# Altium project WPT Round 3 TX.PrjPcb
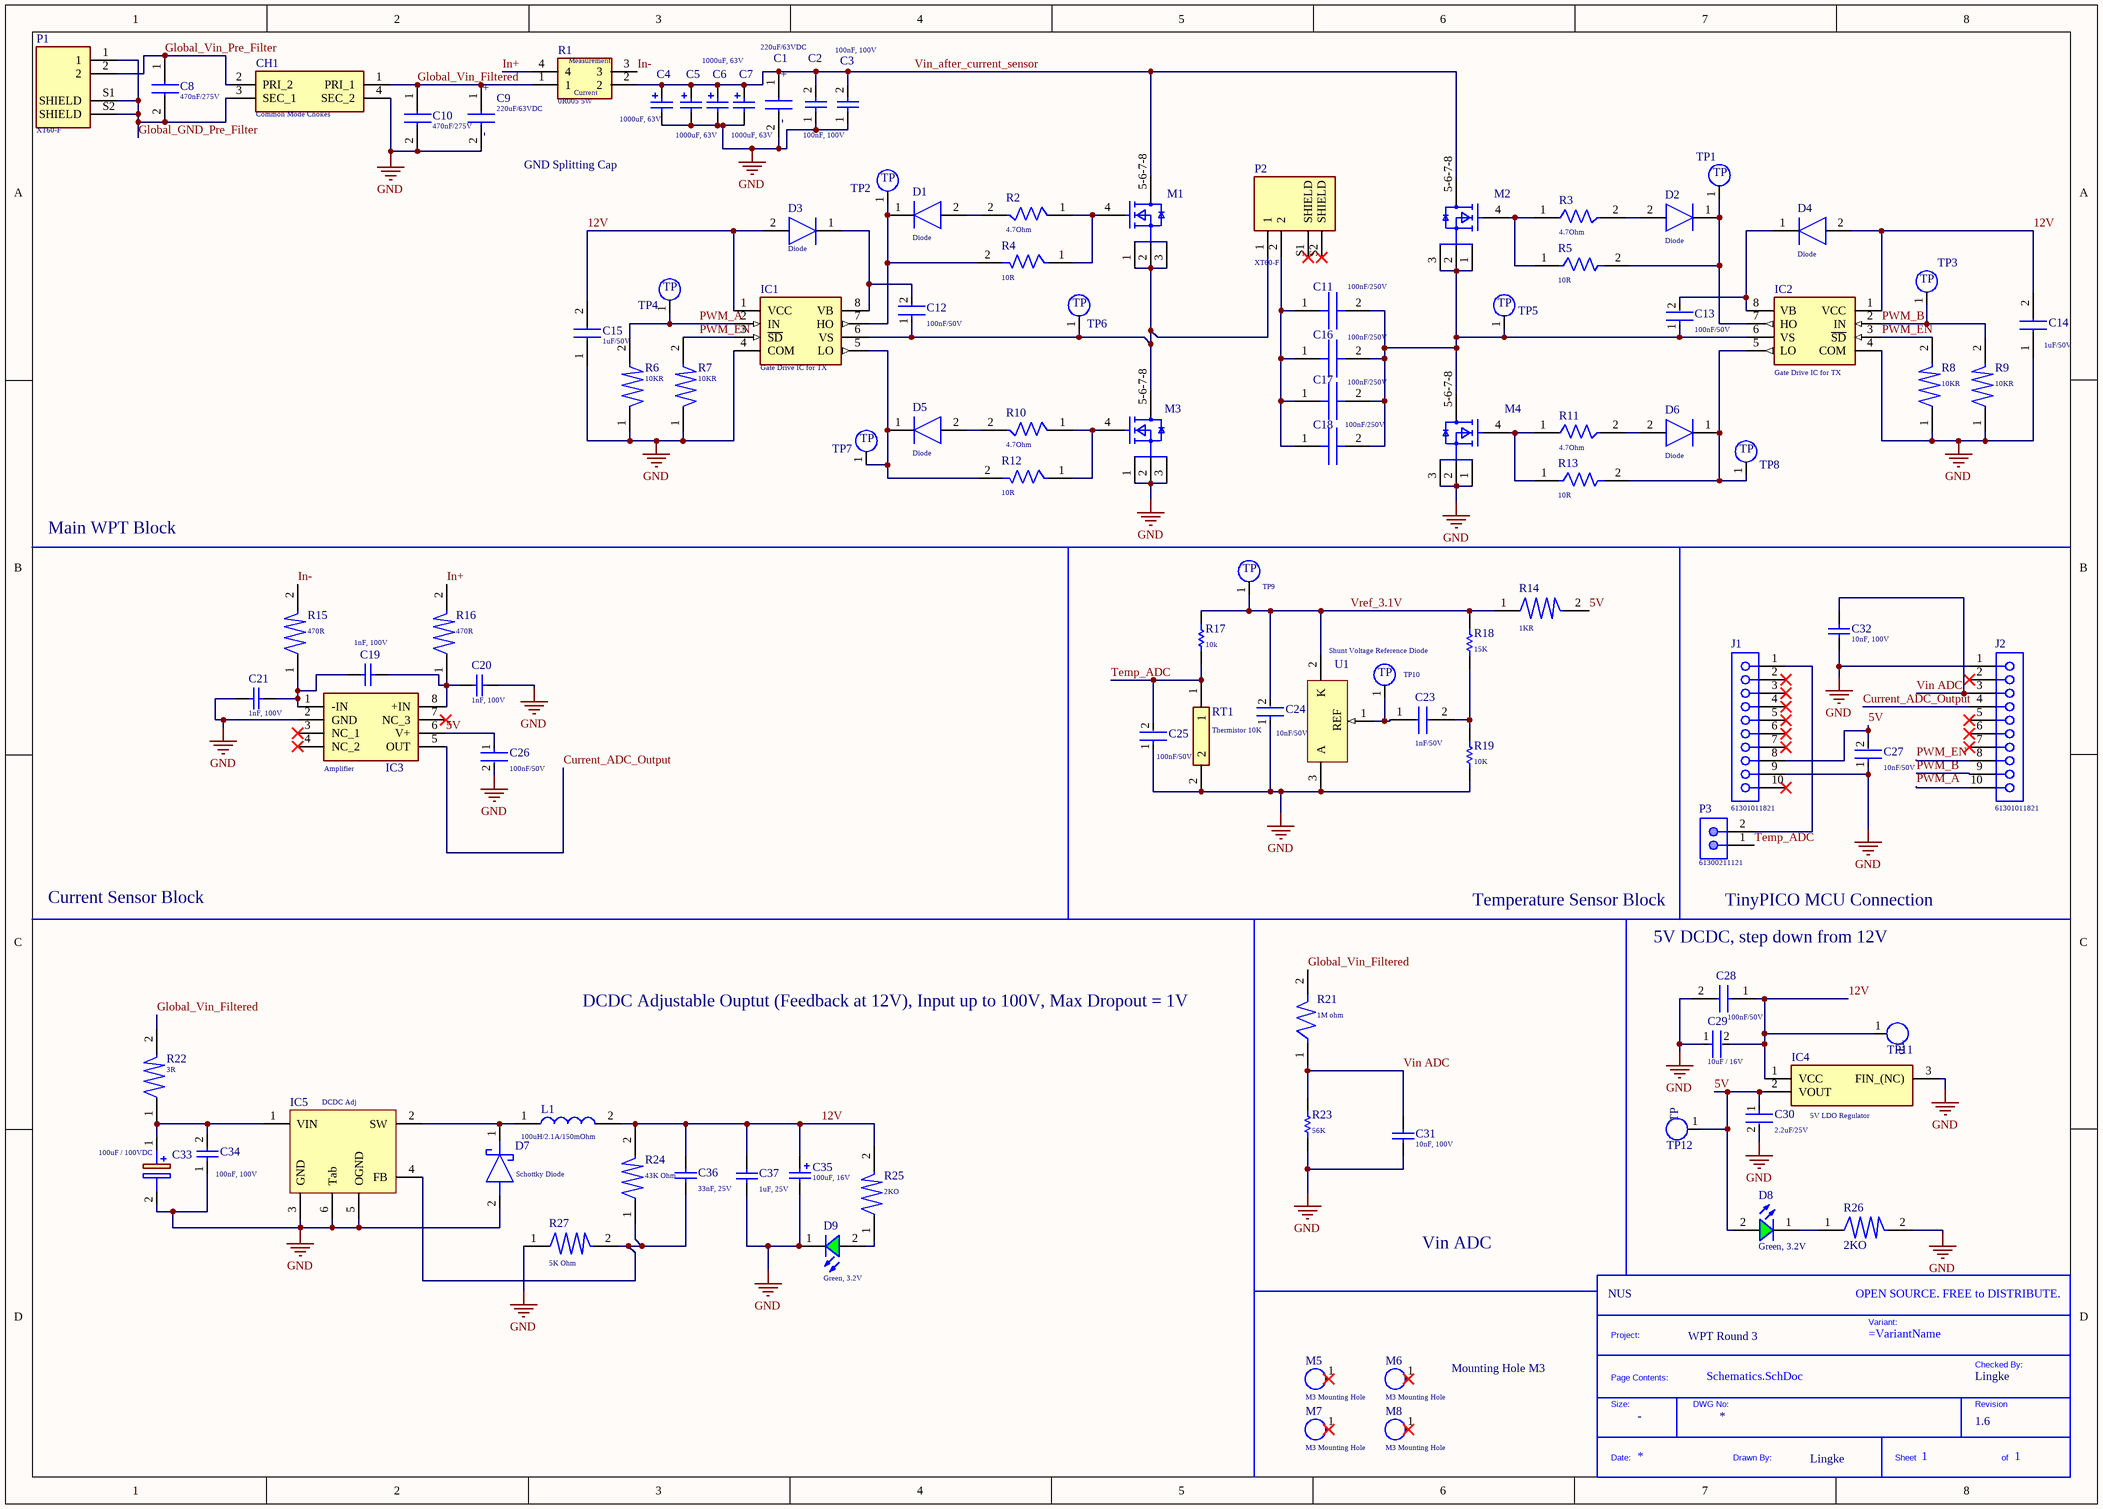
[diagram p0: Schematics.SchDoc]
1 sheet, 106 parts. Net scope: global (net labels, ports and power ports of the same name join across sheets).
Board file: WPT Round 3 TX Layout.PcbDoc

## Sheet Schematics.SchDoc
size A3; SheetNumber: 1; SheetTotal: 1

### Parts
*1  Project Name: WPT Round 3  Company: NUS  Drawn By: Lingke  Revision: 1.6  (hidden comment: Title_Block)  (no BOM)
C1  220uF/63VDC  [CAPPRD500W62D1000H2650]
C2  100nF, 100V  [WCAP-CSGP_0805_H=1.25mm]
C3  100nF, 100V  [WCAP-CSGP_0805_H=1.25mm]
C4  1000uF, 63V  [WCAP-ATG8_D16H25]
C5  1000uF, 63V  [WCAP-ATG8_D16H25]
C6  1000uF, 63V  [WCAP-ATG8_D16H25]
C7  1000uF, 63V  [WCAP-ATG8_D16H25]
C8  470nF/275V  [890324025039CS]
C9  220uF/63VDC  [CAPPRD500W62D1000H2650]
C10  470nF/275V  [890324025039CS]
C11  100nF/250V  [CAPC4532X220N]
C12  100nF/50V  [0805 Capacitor]
C13  100nF/50V  [0805 Capacitor]
C14  1uF/50V  [CAPC2012X135N]
C15  1uF/50V  [CAPC2012X135N]
C16  100nF/250V  [CAPC4532X220N]
C17  100nF/250V  [CAPC4532X220N]
C18  100nF/250V  [CAPC4532X220N]
C19  1nF, 100V  [WCAP-CSGP_0805_H=0.8mm_Reflow]
C20  1nF, 100V  [WCAP-CSGP_0805_H=0.8mm_Reflow]
C21  1nF, 100V  [WCAP-CSGP_0805_H=0.8mm_Reflow]
C23  1nF/50V  [CAPC2012X90N]
C24  10nF/50V  [0805 Capacitor]
C25  100nF/50V  [0805 Capacitor]
C26  100nF/50V  [0805 Capacitor]
C27  10nF/50V  [0805 Capacitor]
C28  100nF/50V  [CAPC2012X90N]
C29  10uF / 16V  [0805 Capacitor]
C30  2.2uF/25V  [0805 Capacitor]
C31  10nF, 100V  [WCAP-CSGP_0805_H=0.8mm_Reflow]
C32  10nF, 100V  [WCAP-CSGP_0805_H=0.8mm_Reflow]
C33  100uF / 100VDC  [CAPPRD500W60D1000H2200]
C34  100nF, 100V  [WCAP-CSGP_0805_H=1.25mm]
C35  100uF, 16V  [WCAP-ASLI_D6.3H5.5]
C36  33nF, 25V  [WCAP-CSGP_0805_H=0.8mm_Reflow]
C37  1uF, 25V  [WCAP-CSGP_0805_H=1.25mm]
CH1  Common Mode Chokes  [PA5141205NLT]
D1  Diode  [SOD3716X135N]
D2  Diode  [SOD3716X135N]
D3  Diode  [SOD3716X135N]
D4  Diode  [SOD3716X135N]
D5  Diode  [SOD3716X135N]
D6  Diode  [SOD3716X135N]
D7  Schottky Diode  [DIONM8059X265N]
D8  Green, 3.2V  [WL-SMCW_0805]
D9  Green, 3.2V  [WL-SMCW_0805]
IC1  Gate Drive IC for TX  [SOIC127P600X175-8N]
IC2  Gate Drive IC for TX  [SOIC127P600X175-8N]
IC3  Amplifier  [SOIC127P600X175-8N]
IC4  5V LDO Regulator  [ROHM_TO-252-3]
IC5  DCDC Adj  [TO-263-5]
J1  61301011821  [61301011821]
J2  61301011821  [61301011821]
L1  100uH/2.1A/150mOhm  [INDPM125125X800N]
M1  Mosfet  [FP-PG-TDSON-8-MFG]  (value not drawn)
M2  Mosfet  [FP-PG-TDSON-8-MFG]  (value not drawn)
M3  Mosfet  [FP-PG-TDSON-8-MFG]  (value not drawn)
M4  Mosfet  [FP-PG-TDSON-8-MFG]  (value not drawn)
M5  M3 Mounting Hole  [M3 Hole]
M6  M3 Mounting Hole  [M3 Hole]
M7  M3 Mounting Hole  [M3 Hole]
M8  M3 Mounting Hole  [M3 Hole]
P1  XT60-F  [AMASS_XT60PW-F]
P2  XT60-F  [AMASS_XT60PW-F]
P3  61300211121  [61300211121]
R1  0R005 5W  [FC4L110R005FER]
R2  4.7Ohm  [FP-CRCW1206-e3-IPC_A]
R3  4.7Ohm  [FP-CRCW1206-e3-IPC_A]
R4  10R  [FP-CRCW1206-e3-IPC_A]
R5  10R  [FP-CRCW1206-e3-IPC_A]
R6  10KR  [FP-CRCW0805-e3-MFG]
R7  10KR  [FP-CRCW0805-e3-MFG]
R8  10KR  [FP-CRCW0805-e3-MFG]
R9  10KR  [FP-CRCW0805-e3-MFG]
R10  4.7Ohm  [FP-CRCW1206-e3-IPC_A]
R11  4.7Ohm  [FP-CRCW1206-e3-IPC_A]
R12  10R  [FP-CRCW1206-e3-IPC_A]
R13  10R  [FP-CRCW1206-e3-IPC_A]
R14  1KR  [FP-CRCW0805-e3-MFG]
R15  470R  [FP-CRCW0805-e3-MFG]
R16  470R  [FP-CRCW0805-e3-MFG]
R17  10k  [0805 Resistor]
R18  15K  [0805 Resistor]
R19  10K  [0805 Resistor]
R21  1M ohm  [FP-CRCW0805-e3-MFG]
R22  3R  [1206_Resistor]
R23  56K  [0805 Resistor]
R24  43K Ohm  [FP-CRCW0805-e3-MFG]
R25  2KO  [FP-CRCW0805-e3-MFG]
R26  2KO  [FP-CRCW0805-e3-MFG]
R27  5K Ohm  [FP-CRCW0805-e3-MFG]
RT1  Thermistor 10K  [THRMC2012X95N]
TP1  TP  [Test Point]  (value not drawn)  (no BOM)
TP2  TP  [Test Point]  (value not drawn)  (no BOM)
TP3  TP  [Test Point]  (value not drawn)  (no BOM)
TP4  TP  [Test Point]  (value not drawn)  (no BOM)
TP5  TP  [Test Point]  (value not drawn)  (no BOM)
TP6  TP  [Test Point]  (value not drawn)  (no BOM)
TP7  TP  [Test Point]  (value not drawn)  (no BOM)
TP8  TP  [Test Point]  (value not drawn)  (no BOM)
TP9  TP  [Test Point]  (value not drawn)  (no BOM)
TP10  TP  [Test Point]  (value not drawn)  (no BOM)
TP11  TP  [Test Point]  (value not drawn)  (no BOM)
TP12  TP  [Test Point]  (value not drawn)  (no BOM)
U1  Shunt Voltage Reference Diode  [SOT23-3_N]

### Nets
GND: C1.2(-) C2.1 C3.1 C4.2(N) C5.2(N) C6.2(N) C7.2(N) C9.2(-) C10.2 C14.1 C15.1 C20.2 C21.1 C24.1 C25.1 C26.2 C27.1 C28.2 C29.1 C30.2 C31.1 C32.1 C33.2(-) C34.1 C35.2(N) C37.1 CH1.4(SEC_2) D7.2(A) D9.1(K) IC1.4(COM) IC2.4(COM) IC3.2(GND) IC4.3(FIN_(NC)) IC5.3(GND) IC5.5(OGND) IC5.6(Tab) J1.9 J2.1 M3.1(S) M3.2(S) M3.3(S) M4.1(S) M4.2(S) M4.3(S) R6.1 R7.1 R8.1 R9.1 R19.1 R23.1 R26.2 R27.1 RT1.2 U1.3(A)
5V: C26.1 C27.2 C30.1 D8.2(A) IC3.6(V+) IC4.2(VOUT) J1.8 R14.2 TP12.1(TP)
12V: C14.2 C15.2 C28.1 C29.2 C35.1(P) C36.2 C37.2 D3.2(A) D4.2(A) IC1.1(VCC) IC2.1(VCC) IC4.1(VCC) L1.2 R24.2 R25.2 TP11.1(TP)
Current_ADC_Output: IC3.5(OUT) J2.4
Global_GND_Pre_Filter: C8.2 CH1.3(SEC_1) P1.1 P1.S1(SHIELD) P1.S2(SHIELD)
Global_Vin_Filtered: C9.1(+) C10.1 CH1.1(PRI_1) R1.1 R21.2 R22.2
Global_Vin_Pre_Filter: C8.1 CH1.2(PRI_2) P1.2
In+: R1.4 R16.2
In-: R1.3 R15.2
PWM_A: IC1.2(IN) J2.10 R6.2 TP4.1(TP)
PWM_B: IC2.2(IN) J2.9 R9.2 TP3.1(TP)
PWM_EN: IC1.3(~{SD}) IC2.3(~{SD}) J2.8 R7.2 R8.2
Temp_ADC: C25.2 P3.1 R17.1 RT1.1
Vin ADC: C31.2 C32.2 J2.3 R21.1 R23.2
Vin_after_current_sensor: C1.1(+) C2.2 C3.2 C4.1(P) C5.1(P) C6.1(P) C7.1(P) M1.5-6-7-8(D) M2.5-6-7-8(D) R1.2
Vref_3.1V: C24.2 R14.1 R17.2 R18.2 TP9.1(TP) U1.2(K)
NetC11_1: C11.1 C16.1 C17.1 C18.1 P2.2
NetC11_2: C11.2 C13.1 C16.2 C17.2 C18.2 IC2.6(VS) M2.1(S) M2.2(S) M2.3(S) M4.5-6-7-8(D) TP5.1(TP)
NetC12_1: C12.1 IC1.6(VS) M1.1(S) M1.2(S) M1.3(S) M3.5-6-7-8(D) P2.1 TP6.1(TP)
NetC12_2: C12.2 D3.1(K) IC1.8(VB)
NetC13_2: C13.2 D4.1(K) IC2.8(VB)
NetC19_1: C19.1 C21.2 IC3.1(-IN) R15.1
NetC19_2: C19.2 C20.1 IC3.8(+IN) R16.1
NetC23_1: C23.1 TP10.1(TP) U1.1(REF)
NetC23_2: C23.2 R18.1 R19.2
NetC33_1: C33.1(+) C34.2 IC5.1(VIN) R22.1
NetC36_1: C36.1 IC5.4(FB) R24.1 R27.2
NetD1_1: D1.1(K) IC1.7(HO) R4.2 TP2.1(TP)
NetD1_2: D1.2(A) R2.2
NetD2_1: D2.1(K) IC2.7(HO) R5.2 TP1.1(TP)
NetD2_2: D2.2(A) R3.2
NetD5_1: D5.1(K) IC1.5(LO) R12.2 TP7.1(TP)
NetD5_2: D5.2(A) R10.2
NetD6_1: D6.1(K) IC2.5(LO) R13.2 TP8.1(TP)
NetD6_2: D6.2(A) R11.2
NetD7_1: D7.1(K) IC5.2(SW) L1.1
NetD8_1: D8.1(K) R26.1
NetD9_2: D9.2(A) R25.1
NetJ1_1: J1.1 P3.2
NetM1_4: M1.4(G) R2.1 R4.1
NetM2_4: M2.4(G) R3.1 R5.1
NetM3_4: M3.4(G) R10.1 R12.1
NetM4_4: M4.4(G) R11.1 R13.1

Not connected (* = marked no-connect by the designer): IC3 3(NC_1)* 4(NC_2)* 7(NC_3)*; J1 2* 3* 4* 5* 6* 7* 10*; J2 2* 5* 6* 7*; M5 1*; M6 1*; M7 1*; M8 1*; P2 S1(SHIELD)* S2(SHIELD)*

### Notes on the sheet
- GND Splitting Cap
- Main WPT Block
- Current Sensor Block
- Temperature Sensor Block
- (near P3) TinyPICO MCU Connection
- (near C28) 5V DCDC, step down from 12V
- (near R21) DCDC Adjustable Ouptut (Feedback at 12V), Input up to 100V, Max Dropout = 1V
- Vin ADC
- Mounting Hole M3
- (in symbol Title_Block) OPEN SOURCE. FREE to DISTRIBUTE.; Variant:; Project:; Checked By:; Page Contents:; Size:; DWG No:; Revision; Date:; Drawn By:; Sheet; of

### Library data of the parts
*1 = Title_Block: Standard Title Block.; DWG No: *; Size: -; Checked By: Lingke
C1 C9 = 860040775010: Polarised Cap, 220uF/63VDC; Manufacturer_Name: Wurth Elektronik; Datasheet Link: https://www.mouser.de/datasheet/2/445/860040775010-1725627.pdf; Height: 26.5mm; Manufacturer_Part_Number: 860040775010
C2 C3 C34 = 885012207128: WCAP-CSGP Multilayer Ceramic Chip Capacitor, General Purpose, size 0805, X7R, 100nF, 100V; Manufacturer: Wurth Elektronik; Rated Voltage: 100VDC; Isolation Resistance: >=1GOhm; Capacitance Tolerance: +/-10%; Technical Reference: X7R0805104K100DFCT10000; ComponentLink1Description: Manufacturer; ComponentLink1URL: http://www.we-online.de; ComponentLink2Description: Datasheet; ComponentLink2URL: https://www.we-online.com/catalog/datasheet/885012207128.pdf; Operating Temperature: -55 to +125degC; Packaging: Tape and Reel; Manufacturer Part Number: 885012207128; Published Date: May 2020; Ceramic Type: X7R; Dissipation Factor: =<2.5%; Height: 1.25mm; Mounting Technology: SMT; Size: 0805; Capacitance: 100nF
C4-C7 = 860010780024: WCAP-ATG8 Aluminum Electrolytic Capacitor, Radial, THT, D16xH25, 1000uF, 63V; Manufacturer: Wurth Elektronik; Ripple Current: 1540mA; Rated Voltage: 63VDC; Technical Reference: ATBK250102M063DSPAEB000; Leakage Current: 630uA; Endurance: 2000h; Dissipation Factor: 9%; Capacitance Tolerance: +/-20%; ComponentLink2Description: Datasheet; Published Date: October 2020; Packaging: Ammo Pack; Operating Temperature: -40 to +85degC; Mounting Technology: THT; Manufacturer Part Number: 860010780024; Height: 25mm; Diameter: 16mm; ComponentLink2URL: https://www.we-online.com/catalog/datasheet/860010780024.pdf; ComponentLink1URL: http://www.we-online.de; ComponentLink1Description: Manufacturer; Capacitance: 1000uF
C8 C10 = 890324025039CS: Safety Capacitor, 470nF/275V; Manufacturer_Name: Wurth Elektronik; Height: 14.5mm; Manufacturer_Part_Number: 890324025039CS
C11 C16-C18 = C1812C104JAGACAUTO: Manufacturer_Name: Kemet; Datasheet Link: https://api.kemet.com/component-edge/download/datasheet/C1812C104JAGACAUTO.pdf; Height: 2.2mm; Manufacturer_Part_Number: C1812C104JAGACAUTO; Supplier Part Number 1: 80-C1812C104JAGAUTO; Supplier 1: Mouser
C12 C13 C25 C26 = 885012207098: Supplier 1: Mouser; Supplier Part Number 1: 710-885012207098
C14 C15 = 885012207103: Capacitor 1uF/50V; Manufacturer_Name: Wurth Elektronik; Datasheet Link: https://katalog.we-online.com/pbs/datasheet/885012207103.pdf; Height: 1.35mm; Manufacturer_Part_Number: 885012207103; Supplier 1: Mouser; Supplier Part Number 1: 710-885012207103
C19-C21 = 885012207116: WCAP-CSGP Multilayer Ceramic Chip Capacitor, General Purpose, size 0805, X7R, 1nF, 100V; Manufacturer: Wurth Elektronik; Rated Voltage: 100VDC; Isolation Resistance  min.: 10GOhm; Capacitance Tolerance: +/-10%; Dissipation Factor max.: 2.5%; Technical Reference: X7R0805102K100DFCT10000; ComponentLink1Description: Manufacturer; ComponentLink1URL: http://www.we-online.de; ComponentLink2Description: Datasheet; ComponentLink2URL: https://www.we-online.com/catalog/datasheet/885012207116.pdf; Operating Temperature: -55 to +125degC; Packaging: Tape and Reel; Manufacturer Part Number: 885012207116; Published Date: April 2021; Ceramic Type: X7R; Height: 0.8mm; Mounting Technology: SMT; Size: 0805; Capacitance: 1nF; Q-Factor min.: -
C23 = 885012207086: Manufacturer_Name: Wurth Elektronik; Datasheet Link: https://katalog.we-online.com/pbs/datasheet/885012207086.pdf; Height: 0.9mm; Manufacturer_Part_Number: 885012207086; Supplier 1: Mouser; Supplier Part Number 1: 710-885012207086
C24 C27 = 885012207092: Supplier 1: Mouser; Supplier Part Number 1: 710-885012207092
C28 = 885012207098: Manufacturer_Name: Wurth Elektronik; Height: 0.9mm; Supplier 1: Mouser; Supplier Part Number 1: 710-885012207098
C29 = CL21A106KOQNNNE: 100nF/50V; Supplier 1: Mouser; Supplier Part Number 1: 710-885012207098
C30 = 885012207079: Dielectric: X5R; Capacitance: 2.2; Voltage Rating (DC): 25V; Max Operating Temperature: 125°C; Case/Package: 0805; Package Quantity: 2000; Case Code (Metric): 2012; Case Code (Imperial): 0805; Supplier 1: Mouser; Supplier Part Number 1: 710-885012207079
C31 C32 = 885012207122: WCAP-CSGP Multilayer Ceramic Chip Capacitor, General Purpose, size 0805, X7R, 10nF, 100V; Manufacturer: Wurth Elektronik; Rated Voltage: 100VDC; Isolation Resistance  min.: 10GOhm; Capacitance Tolerance: +/-10%; Dissipation Factor max.: 2.5%; Technical Reference: X7R0805103K100DFCT10000; ComponentLink1Description: Manufacturer; ComponentLink1URL: http://www.we-online.de; ComponentLink2Description: Datasheet; ComponentLink2URL: https://www.we-online.com/catalog/datasheet/885012207122.pdf; Operating Temperature: -55 to +125degC; Packaging: Tape and Reel; Manufacturer Part Number: 885012207122; Published Date: April 2021; Ceramic Type: X7R; Height: 0.8mm; Mounting Technology: SMT; Size: 0805; Capacitance: 10nF; Q-Factor min.: -
C33 = ESH107M100AH4AA: Capacitor Polarised; Manufacturer_Name: Kemet; Datasheet Link: https://componentsearchengine.com/Datasheets/1/ESH107M100AH4AA.pdf; Height: 22mm; Manufacturer_Part_Number: ESH107M100AH4AA; Mouser Part Number: 80-ESH107M100AH4AA; Mouser Price/Stock: https://www.mouser.co.uk/ProductDetail/KEMET/ESH107M100AH4AA?qs=gt1LBUVyoHkVRbiIYuZpEw%3D%3D
C35 = 865080343009: WCAP-ASLI Aluminum Electrolytic Capacitor, V-Chip, SMT, D6.3xH5.5mm, 100uF, 16V; Manufacturer: Wurth Elektronik; Technical Reference: ASED055101M016DVCTBB000; Ripple Current: 255mA; Capacitance Tolerance: +/-20%; Leakage Current: 16uA; Endurance: 2000h; Dissipation Factor: 16%; Rated Voltage: 16VDC; Packaging: Tape and Reel; Published Date: October 2020; Operating Temperature: -55 to +105degC; Mounting Technology: SMT; Manufacturer Part Number: 865080343009; Height: 5.5mm; Capacitance: 100uF; ComponentLink1Description: Manufacturer; ComponentLink1URL: http://www.we-online.de; ComponentLink2Description: Datasheet; ComponentLink2URL: https://www.we-online.com/catalog/datasheet/865080343009.pdf; Diameter: 6.3mm
C36 = 885012207069: WCAP-CSGP Multilayer Ceramic Chip Capacitor, General Purpose, size 0805, X7R, 33nF, 25V; Manufacturer: Wurth Elektronik; Rated Voltage: 25VDC; Isolation Resistance  min.: 10GOhm; Capacitance Tolerance: +/-10%; Dissipation Factor max.: 3.5%; Technical Reference: X7R0805333K025DFCT10000; ComponentLink1Description: Manufacturer; ComponentLink1URL: http://www.we-online.de; ComponentLink2Description: Datasheet; ComponentLink2URL: https://www.we-online.com/catalog/datasheet/885012207069.pdf; Operating Temperature: -55 to +125degC; Packaging: Tape and Reel; Manufacturer Part Number: 885012207069; Published Date: April 2021; Ceramic Type: X7R; Height: 0.8mm; Mounting Technology: SMT; Size: 0805; Capacitance: 33nF; Q-Factor min.: -
C37 = 885012207078: WCAP-CSGP Multilayer Ceramic Chip Capacitor, General Purpose, size 0805, X7R, 1uF, 25V; Manufacturer: Wurth Elektronik; Rated Voltage: 25VDC; Isolation Resistance  min.: 0.5GOhm; Capacitance Tolerance: +/-10%; Dissipation Factor max.: 5%; Technical Reference: X7R0805105K025DFCT10000; ComponentLink1Description: Manufacturer; ComponentLink1URL: http://www.we-online.de; ComponentLink2Description: Datasheet; ComponentLink2URL: https://www.we-online.com/catalog/datasheet/885012207078.pdf; Operating Temperature: -55 to +125degC; Packaging: Tape and Reel; Manufacturer Part Number: 885012207078; Published Date: April 2021; Ceramic Type: X7R; Height: 1.25mm; Mounting Technology: SMT; Size: 0805; Capacitance: 1uF; Q-Factor min.: -
CH1 = PA5141.205NLT: Filter; Manufacturer_Name: Pulse; Datasheet Link: https://products.pulseelex.com/files/product_files/P860.pdf; Height: 22.7mm; Manufacturer_Part_Number: PA5141.205NLT; Mouser Part Number: 673-PA5141.205NLT; Mouser Price/Stock: https://www.mouser.co.uk/ProductDetail/Pulse-Electronics/PA5141205NLT?qs=l7cgNqFNU1hhs8iQ7nyooA%3D%3D
D1-D6 = 1N4148W-E3-08: Manufacturer_Name: Vishay; Datasheet Link: https://componentsearchengine.com//1N4148W-E3-08.pdf; Height: 1.35mm; Mouser2 Part Number: 78-1N4148W-E3-08; Mouser2 Price/Stock: https://www.mouser.com/Search/Refine.aspx?Keyword=78-1N4148W-E3-08; Manufacturer_Part_Number: 1N4148W-E3-08; Supplier 1: Digi-Key; Supplier Part Number 1: 1N4148W-E3-08CT-ND
D7 = S310: Manufacturer_Name: ON Semiconductor; Datasheet Link: https://componentsearchengine.com/Datasheets/2/S310.pdf; Height: 2.65mm; Manufacturer_Part_Number: S310; Mouser Part Number: 512-S310; Mouser Price/Stock: https://www.mouser.co.uk/ProductDetail/ON-Semiconductor-Fairchild/S310?qs=AZz8fAaf6P%2FJSlbiibJLxA%3D%3D; Arrow Part Number: S310; Arrow Price/Stock: https://www.arrow.com/en/products/s310/on-semiconductor?region=nac
D8 D9 = 150080GS75000: WL-SMCW SMT Mono-color Chip LED Waterclear, size 0805, Green, 3.2V, 140deg; Chip Technology: InGaN; Dominant Wavelength typ.: 525nm; Luminous Intensity typ.: 450mcd; Peak Wavelength typ.: 515nm; Viewing Angle: 140deg; ComponentLink1Description: Manufacturer; ComponentLink1URL: http://www.we-online.de; ComponentLink2URL: https://www.we-online.com/catalog/datasheet/150080GS75000.pdf; ComponentLink2Description: Datasheet; Forward Voltage typ.: 3.2V; Emitting Color: Green; Mounting Technology: SMT; Operating Temperature: -40 to +85degC; Published Date: December 2019; Part Number: 150080GS75000; Packaging: Tape and Reel; Size: 0805; Publisher: Wurth Elektronik
IC1 IC2 = IRS2008SPBF: Gate Drive IC; Manufacturer_Name: Infineon; Height: 1.75mm; Manufacturer_Part_Number: IRS2008SPBF; Supplier 1: Mouser; Supplier Part Number 1: 726-IRS2008SPBF
IC3 = AD8215YRZ: Integrated Circuit Amplifier; Manufacturer_Name: Analog Devices; Datasheet Link: http://www.analog.com/static/imported-files/data_sheets/AD8215.pdf; Height: 1.75mm; Manufacturer_Part_Number: AD8215YRZ; Supplier 1: Mouser; Supplier Part Number 1: 584-AD8215YRZ
IC4 = BD450M5FP-CE2: Manufacturer_Name: ROHM Semiconductor; Datasheet Link: https://componentsearchengine.com//BD450M5FP-CE2.pdf; Mouser2 Part Number: 755-BD450M5FP-CE2; Mouser2 Price/Stock: https://www.mouser.com/Search/Refine.aspx?Keyword=755-BD450M5FP-CE2; Manufacturer_Part_Number: BD450M5FP-CE2
IC5 = XL7035E1
J1 J2 = 61301011821: WR-PHD Socket Header, THT, pitch 2.54mm, Single Row, Vertical, 10p; Manufacturer: Wurth Elektronik; Pin Number: 10; Rated Current: 3A; Working Voltage: 250VAC; Withstanding Voltage: 500VAC; Contact Resistance: 20mOhm; ComponentLink1Description: Manufacturer; ComponentLink1URL: http://www.we-online.de; ComponentLink2Description: Datasheet; ComponentLink2URL: https://www.we-online.com/catalog/datasheet/61301011821.pdf; Manufacturer Part Number: 61301011821; Published Date: May 2020; Pitch: 2.54mm; Operating Temperature: -40 to +125degC; Mounting Technology: THT; Packaging: Tray; Gender: Socket Header; Row Number: Single; Orientation: Vertical
L1 = SRR1280-101M: Inductor; Manufacturer_Name: Bourns; Datasheet Link: https://componentsearchengine.com/Datasheets/2/SRR1280-101M.pdf; Height: 8mm; Manufacturer_Part_Number: SRR1280-101M; Mouser Part Number: 652-SRR1280-101M; Mouser Price/Stock: https://www.mouser.co.uk/ProductDetail/Bourns/SRR1280-101M?qs=brMhP%2FMjUfd8D85Ep5aW7g%3D%3D; Arrow Part Number: SRR1280-101M; Arrow Price/Stock: https://www.arrow.com/en/products/srr1280-101m/bourns
M1-M4 = BSC040N10NS5ATMA1: MOSFET N-CH 100V 100A 8TDSON / Mosfet Switcher; Manufacturer: Infineon; Threshold Vgs Max: 3.8V; Reverse Recovery Charge: 90nC; Number Of N Channels: 1; Input Capacitace At Vds: 4100pF @ 50V; Turn On Delay Time: 13ns; Drain To Source Resistance: 3.4mΩ; Max Junction Temp: +150°C; Transconductance: 120S; Power Dissipation: 139W; Gate Charge At Vgs: 58nC @ 10V; Threshold Vgs Min: 2.2V; Typ Forward Diode Voltage: 0.9V; Depletion Mode: False; Gate To Source Voltage: 20V; Rthja Max: 50K/W; Pulse Drain Current: 400A; Turn Off Delay Time: 32ns; Max Forward Diode Voltage: 1.1V; Reverse Recovery Time: 54ns; ComponentLink2Description: Datasheet; Temperature Range Low: -55°C; Automotive: No; Number Of Channels: 1; Mouser Description: MOSFET N-Ch 100V 100A TDSON-8; Height: 1.1mm; Temperature Range High: +150°C; Drain To Source Breakdown Voltage: 100V; Temperature: -55°C to +150°C; Device Class L3: MOSFETs; Drain To Source Voltage: 100V; Digikey Description: MOSFET N-CH 100V 100A 8TDSON; Continuous Drain Current: 100A; Package: PG-TDSON-8; Lead Free: Yes; ComponentLink2URL: https://www.infineon.com/dgdl/Infineon-BSC040N10NS5-DS-v02_02-EN.pdf?fileId=5546d4624a0bf290014a0fbcee2e6b38; Manufacturer Part Number: BSC040N10NS5ATMA1; Footprint Url: https://www.infineon.com/dgdl/Infineon-PG-TDSON-8-7-FP-v01_00-EN.pdf?fileId=5546d46259d9a4bf015a1b6adadd1f0a; Device Class L2: Transistors; Category: Trans; RoHS: TRUE; Device Class L1: Discrete Semiconductors; Octopart: https://octopart.com/bsc040n10ns5atma1-infineon-52825711; Supplier 1: Mouser; Supplier Part Number 1: 726-BSC040N10NS5ATMA
M5-M8 = M3_Mounting_hole
P1 P2 = XT60PW-F: Socket DC Supply Connector Female; MF: AMASS; Availability: Unavailable; SnapEDA_Link: https://www.snapeda.com/parts/XT60PW-F/AMASS/view-part/2890674/?ref=snap; MP: XT60PW-F; Value: *; Price: None; Package: Package; BuyPart: https://www.snapeda.com/parts/XT60PW-F/AMASS/view-part/2890674/?ref=eda
P3 = 61300211121: WR-PHD Pin Header, THT, pitch 2.54mm, Single Row, Vertical, 2p; Manufacturer: Wurth Elektronik; Pin Number: 2; Rated Current: 3A; Working Voltage: 250VAC; Withstanding Voltage: 500VAC; Contact Resistance: 20mOhm; ComponentLink1Description: Manufacturer; ComponentLink1URL: http://www.we-online.de; ComponentLink2Description: Datasheet; ComponentLink2URL: https://www.we-online.com/catalog/datasheet/61300211121.pdf; Manufacturer Part Number: 61300211121; Published Date: May 2020; Pitch: 2.54mm; Operating Temperature: -40 to +105degC; Mounting Technology: THT; Packaging: Bag; Gender: Pin Header; Row Number: Single; Orientation: Vertical
R1 = FC4L110R005FER: Resistor 0R005 5W; Manufacturer_Name: Ohmite; Height: 0.7mm; Manufacturer_Part_Number: FC4L110R005FER; Supplier 1: Mouser; Supplier Part Number 1: 588-FC4L110R005FER
R2 R3 R10 R11 = CRCW12064R70FKEA: RES Thick Film, 4.7Ω, 1%, 0.25W, 100ppm/°C, 1206 / MOSFET Gate Fast-off Resistor 4.7Ohm; Resistance: 4.7R; Power Rating: 250mW; Voltage Rating: 200V; Length: 3.2mm; Composition: Thick Film; Weight: 0.000353oz; Temperature Coefficient: 100ppm/°C; Height: 0.024inch; Case Code (Imperial): 1206; Width: 0.063inch; Number of Terminations: 2; Case Code (Metric): 3216; Features: Automotive AEC-Q200; Packaging: Tape and Reel; Tolerance: 1%; Contact Plating: Tin; Military Standard: Not; Depth: 1.6mm; Max Operating Temperature: 155°C; Number of Pins: 2; Min Operating Temperature: -55°C; Max Power Dissipation: 250mW; Mount: Surface Mount; Case/Package: 1206; Package Quantity: 10; Radiation Hardening: No; Supplier 1: Mouser; Supplier Part Number 1: 71-CRCW12064R70FKEA
R4 R5 R12 R13 = CRCW120610R0FKEA: RES Thick Film, 10Ω, 1%, 0.25W, 100ppm/°C, 1206 / MOSFET Gate Resistor 10Ohm; Power Rating: 250mW; Voltage Rating (DC): 200V; Number of Terminations: 2; Width: 0.063inch; Case Code (Imperial): 1206; Depth: 1.6mm; Contact Plating: Tin; Radiation Hardening: No; Lead Free: Lead Free; Length: 3.2mm; Tolerance: 1%; Max Power Dissipation: 250mW; Composition: Thick Film; Weight: 0.000353oz; Case/Package: 1206; Number of Pins: 2; Package Quantity: 10; Min Operating Temperature: -55°C; Military Standard: Not; Max Operating Temperature: 155°C; Termination: SMD/SMT; Case Code (Metric): 3216; Voltage Rating: 200V; Height: 0.55mm; Features: Automotive AEC-Q200; Temperature Coefficient: 100ppm/°C; Resistance: 10R; Packaging: Tape and Reel; Supplier 1: Digi-Key; Supplier Part Number 1: 541-10.0FDKR-ND
R6-R9 = CRCW080510K0FKEA: Resistor 10K Ohm; Number of Terminations: 2; Supplier 1: Mouser; Supplier Part Number 1: 71-CRCW0805-10K-E3
R14 = CRCW08051K00FKEA: Resistor 1k Ohm; Number of Terminations: 2; Supplier 1: Mouser; Supplier Part Number 1: 71-CRCW0805-1.0K-E3
R15 R16 = CRCW0805470RFKEB: Resistor 470 Ohm; Number of Terminations: 2; Supplier 1: Mouser; Supplier Part Number 1: 71-CRCW0805470RFKEB
R17 = ERA-6ARB103V: High Presition and High reliability 10K Ohm Resistor; Supplier 1: Mouser; Supplier Part Number 1: 667-ERA-6ARB103V
R18 = ERA-6ARW153V: High Presicion 15K Ohm; Supplier 1: Mouser; Supplier Part Number 1: 667-ERA-6ARW153V
R19 = CRCW080510K0FKEB: High Presicion 10K Ohm; Supplier 1: Newark; Supplier Part Number 1: 26R4046
R21 = CRCW08051M00FKEA: RES Thick Film, 1MΩ, 1%, 0.125W, 100ppm/°C, 0805 / 1M Ohm Resistor; Voltage Rating (DC): 150V; Resistance: 1MR; Power Rating: 125mW; Packaging: Tape and Reel; Case Code (Metric): 2012; Case/Package: 0805; Width: 1.25mm; Mount: Surface Mount; Military Standard: Not; Radiation Hardening: No; Weight: 0.000194oz; Package Quantity: 5000; Max Operating Temperature: 155°C; Contact Plating: Tin; Composition: Thick Film; Number of Pins: 2; Tolerance: 1%; Termination: SMD/SMT; Case Code (Imperial): 0805; Depth: 1.25mm; Temperature Coefficient: 100ppm/°C; Min Operating Temperature: -55°C; Height: 0.45mm; Lead Free: Lead Free; Length: 2mm; Voltage Rating: 150V; Supplier 1: Mouser; Supplier Part Number 1: 71-CRCW08051M00FKEAH
R22 = CRCW12063R00FKEAHP: Resistor 3 Ohm; Number of Terminations: 2; Supplier 1: Mouser; Supplier Part Number 1: 71-CRCW0805-10K-E3
R23 = ERJ-6ENF5622V: 56K Ohm Resistor; Supplier 1: Mouser; Supplier Part Number 1: 667-ERJ-6ENF5622V
R24 = RC0805FR-0743KL: Resistor 43K Ohm; Number of Terminations: 2; Supplier 1: Mouser; Supplier Part Number 1: 71-CRCW08051K30FKEB
R25 R26 = CRCW08052K00FKEB: RES Thick Film, 2kΩ, 1%, 0.125W, 100ppm/°C, 0805; Voltage Rating (DC): 150V; Power Rating: 125mW; Resistance: 2kR; Number of Terminations: 2; Weight: 0.000194oz; Contact Plating: Tin; Radiation Hardening: No; Package Quantity: 10000; Lead Free: Lead Free; Case Code (Metric): 2012; Height: 0.02inch; Case/Package: 0805; Width: 0.049inch; Max Operating Temperature: 155°C; Packaging: Tape and Reel; Termination: SMD/SMT; Temperature Coefficient: 100ppm/°C; Composition: Thick Film; Features: Automotive AEC-Q200; Min Operating Temperature: -55°C; Voltage Rating: 150V; Number of Pins: 2; Length: 0.079inch; Case Code (Imperial): 0805; Max Power Dissipation: 125mW; Tolerance: 1%; Supplier Part Number 1: 71-CRCW08052K00FKEB; Supplier 1: Mouser
R27 = CRCW08055K00FKTA: Resistor 5K Ohm; Number of Terminations: 2; Supplier 1: Mouser; Supplier Part Number 1: 71-CRCW08051K30FKEB
RT1 = NTCS0805E3103HMT: Thermistor 10Kohm B Parameter: 3950k; Manufacturer_Name: Vishay; Datasheet Link: http://www.vishay.com/docs/29044/ntcs0805e3t.pdf; Height: 0.95mm; Manufacturer_Part_Number: NTCS0805E3103HMT; Supplier 1: Mouser; Supplier Part Number 1: 594-NTCS0805E3103HMT
TP1-TP12 = Test Point: Test Point 1mm by 1mm
U1 = TS432AILT: Shunt voltage reference, adjustable, 1.24 to 10V, 0.5% precision, 3-Pin SOT23-3L, Tape and Reel; ComponentLink1URL: http://www.st.com; PackageDescription: 3-Pin SOT-23 Package 0.95 mm Pitch, 2.4 mm Lead Span; ComponentLink2Description: Datasheet; DatasheetVersion: Apr-2008; ComponentLink1Description: Manufacturer URL; ComponentLink2URL: http://www.st.com/internet/com/TECHNICAL_RESOURCES/TECHNICAL_LITERATURE/DATASHEET/CD00003202.pdf; PackageVersion: 2011; PackageReference: SOT23-3; Supplier 1: Digi-Key; Supplier Part Number 1: 497-TS432AILTCT-ND